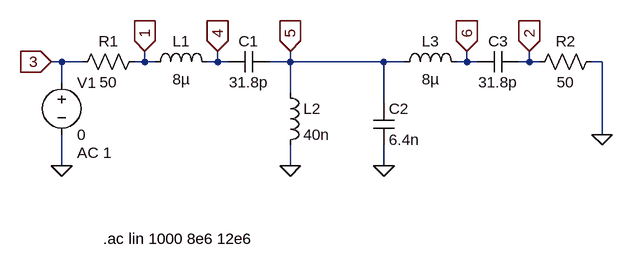
[diagram p0: schematic Two port circuit BPF-backup.asc]
Two port circuit BPF-backup.asc, the LTspice schematic file:
Version 4
SHEET 1 880 680
WIRE -400 48 -416 48
WIRE -368 48 -400 48
WIRE -272 48 -272 32
WIRE -272 48 -288 48
WIRE -256 48 -272 48
WIRE -160 48 -160 32
WIRE -160 48 -176 48
WIRE -144 48 -160 48
WIRE -48 48 -48 32
WIRE -48 48 -80 48
WIRE 96 48 -48 48
WIRE 128 48 96 48
WIRE 224 48 224 32
WIRE 224 48 208 48
WIRE 240 48 224 48
WIRE 320 48 320 32
WIRE 320 48 304 48
WIRE 336 48 320 48
WIRE 432 48 416 48
WIRE -400 80 -400 48
WIRE -48 96 -48 48
WIRE 96 112 96 48
WIRE 432 160 432 48
WIRE -400 208 -400 160
WIRE -48 208 -48 176
WIRE 96 208 96 176
FLAG -400 208 0
FLAG -160 32 4
IOPIN -160 32 In
FLAG -272 32 1
IOPIN -272 32 In
FLAG 320 32 2
IOPIN 320 32 In
FLAG -416 48 3
IOPIN -416 48 In
FLAG -48 208 0
FLAG 96 208 0
FLAG 432 160 0
FLAG -48 32 5
IOPIN -48 32 In
FLAG 224 32 6
IOPIN 224 32 In
SYMBOL voltage -400 64 R0
WINDOW 123 24 124 Left 2
WINDOW 39 0 0 Left 2
SYMATTR Value2 AC 1
SYMATTR InstName V1
SYMATTR Value 0
SYMBOL res -384 64 R270
WINDOW 0 32 56 VTop 2
WINDOW 3 0 56 VBottom 2
SYMATTR InstName R1
SYMATTR Value 50
SYMBOL res 320 64 R270
WINDOW 0 32 56 VTop 2
WINDOW 3 0 56 VBottom 2
SYMATTR InstName R2
SYMATTR Value 50
SYMBOL cap -144 64 R270
WINDOW 0 32 32 VTop 2
WINDOW 3 0 32 VBottom 2
SYMATTR InstName C1
SYMATTR Value 31.8p
SYMBOL cap 80 112 R0
SYMATTR InstName C2
SYMATTR Value 6.4n
SYMBOL ind -272 64 R270
WINDOW 0 32 56 VTop 2
WINDOW 3 5 56 VBottom 2
SYMATTR InstName L1
SYMATTR Value 8µ
SYMBOL ind -64 80 R0
SYMATTR InstName L2
SYMATTR Value 40n
SYMBOL ind 112 64 R270
WINDOW 0 32 56 VTop 2
WINDOW 3 5 56 VBottom 2
SYMATTR InstName L3
SYMATTR Value 8µ
SYMBOL cap 240 64 R270
WINDOW 0 32 32 VTop 2
WINDOW 3 0 32 VBottom 2
SYMATTR InstName C3
SYMATTR Value 31.8p
TEXT -336 320 Left 2 !.ac lin 1000 8e6 12e6

The netlist it stands for:
* Two port circuit BPF-backup.asc
V1 3 0 0 AC 1
R1 3 1 50
R2 2 0 50
C1 4 5 31.8p
C2 5 0 6.4n
L1 1 4 8µ
L2 5 0 40n
L3 5 6 8µ
C3 6 2 31.8p
.ac lin 1000 8e6 12e6
.backanno
.end